# Altium project ElectrisenseAnalogConditioningBoard (Hank Herman's conflicted copy 2011-05-26).PrjPcb (part 2 of 5)
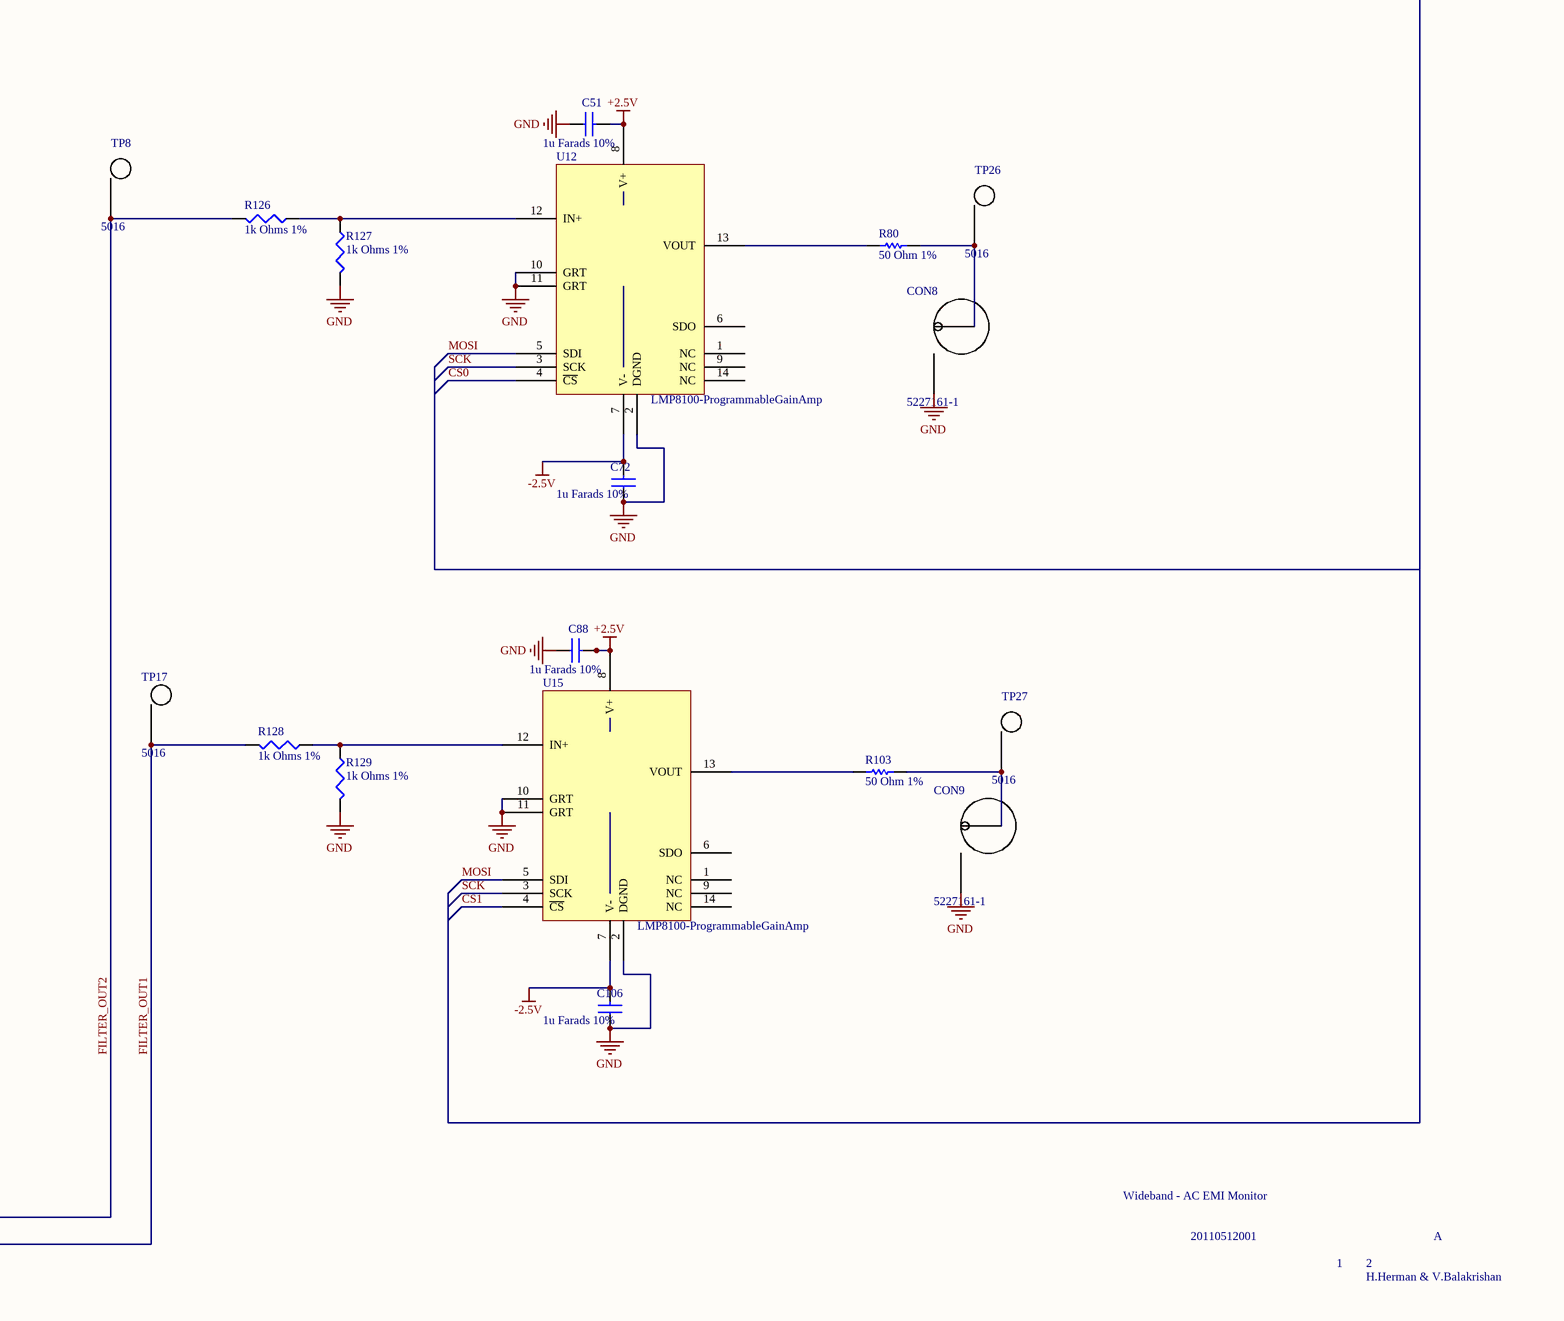
[diagram p9: ESense.SchDoc, bottom right]